# Altium schematic sheet Mechanical.SchDoc
size A4; SheetNumber: 9; SheetTotal: 9
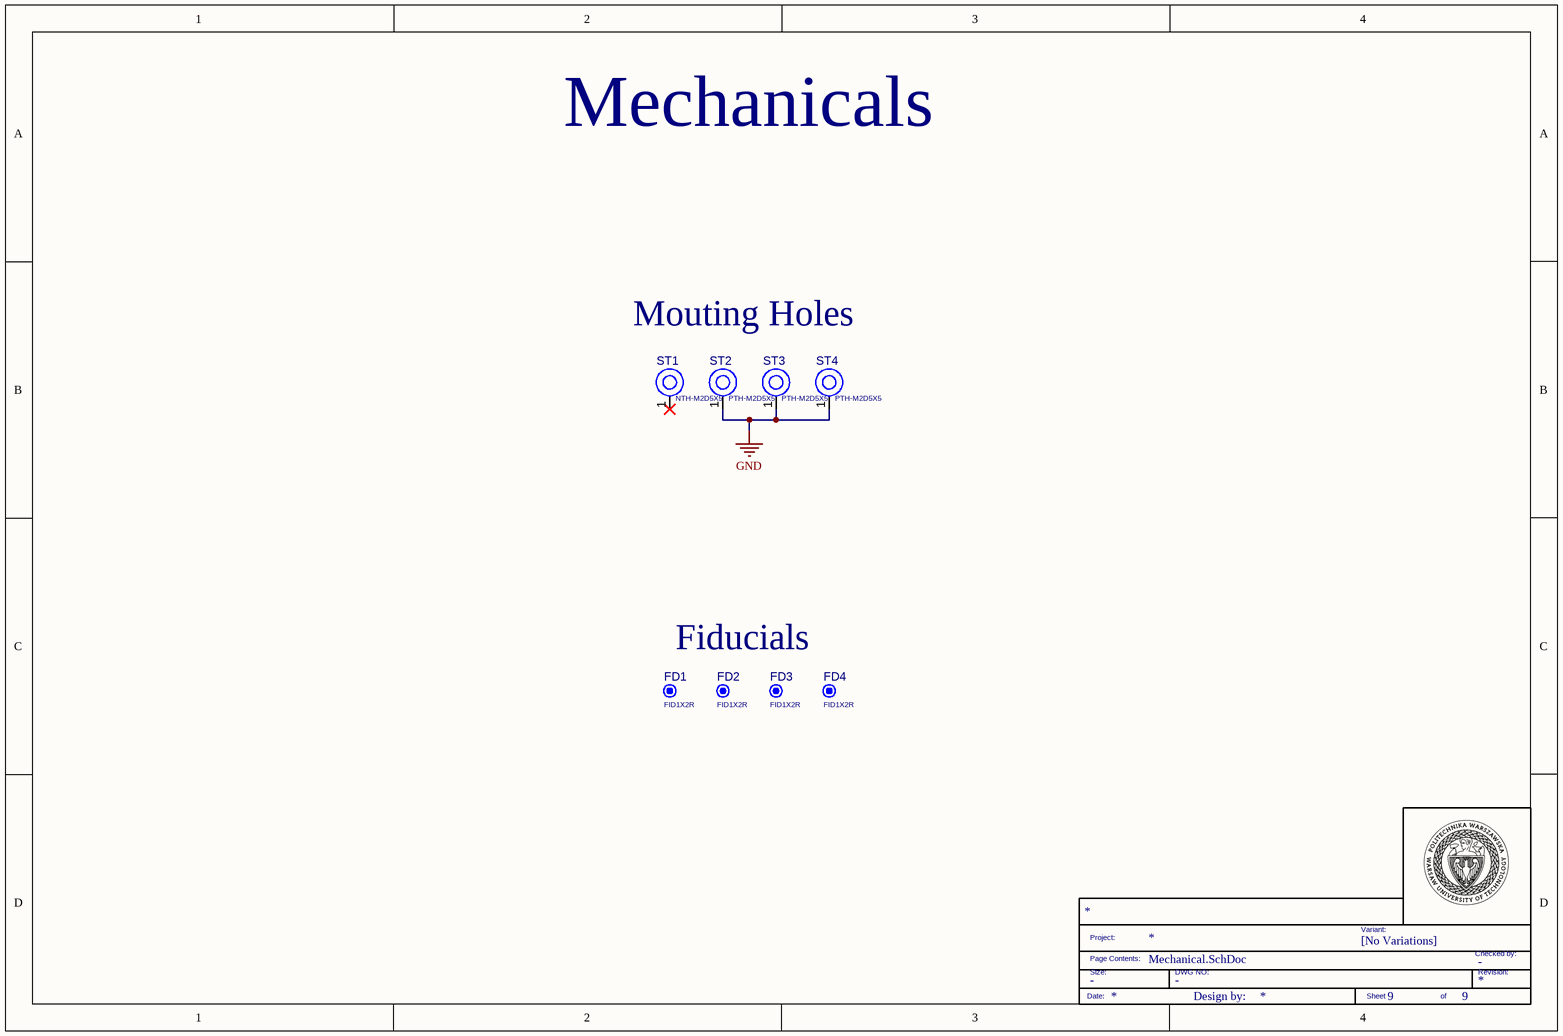
[diagram p0: Mechanical.SchDoc]

## Parts
*?  TITLE_BLOCK  (value not drawn)  (graphical)
FD1  FID1X2R  [FID1X2R]  (no BOM)
FD2  FID1X2R  [FID1X2R]  (no BOM)
FD3  FID1X2R  [FID1X2R]  (no BOM)
FD4  FID1X2R  [FID1X2R]  (no BOM)
ST1  NTH-M2D5X5  [PTH-M2D5X5]
ST2  PTH-M2D5X5  [PTH-M2D5X5]
ST3  PTH-M2D5X5  [PTH-M2D5X5]
ST4  PTH-M2D5X5  [PTH-M2D5X5]

## Nets
GND: ST2.1(H1) ST3.1(H1) ST4.1(H1)

Not connected (* = marked no-connect by the designer): ST1 1(H1)*

## Notes on the sheet
- Mechanicals
- Mouting Holes
- Fiducials
- (in symbol CMP-003-000005-7) Variant:; Project:; [No Variations]; Checked by:; Page Contents:; Size:; DWG NO:; Revision:; Date:; Design by:; Sheet; of

## Library data of the parts
*? = CMP-003-000005-7: TITLEBLOCK; DWG NO: -; Size: -; Checked by: -; Design Item ID: TITLE_BLOCK; Source: TITLEBLOCK.SchLib
FD1-FD4 = CMP-00028-00005-2: Fiducial - Round 1x2mm; Pins: 0
ST1 = CMP-00028-00009-2: M2 PTH (2.5mm), 5mm pad; Pins: 1
ST2-ST4 = CMP-00028-00004-2: M2 PTH (2.5mm), 5mm pad; Pins: 1